# Altium project System Control.PrjPCB (part 3 of 3)

## Sheet System Control - Serial Port.SchDoc
size B; PageSetup: Record=PageOptions|CenterHorizontal=True|CenterVertical=True|PrintScale=1.09|XCorrection=1.00|YCorrection=1.00|PrintKind=1|BorderSize=5000000|LeftOffset=0|BottomOffset=0|Orientation=2|PaperLength=1000|PaperWidth=1000|Scale=100|PaperSource=261|PrintQuality=600|MediaType=1|DitherType=10|PaperKind=11x17|PrintScaleMode=1
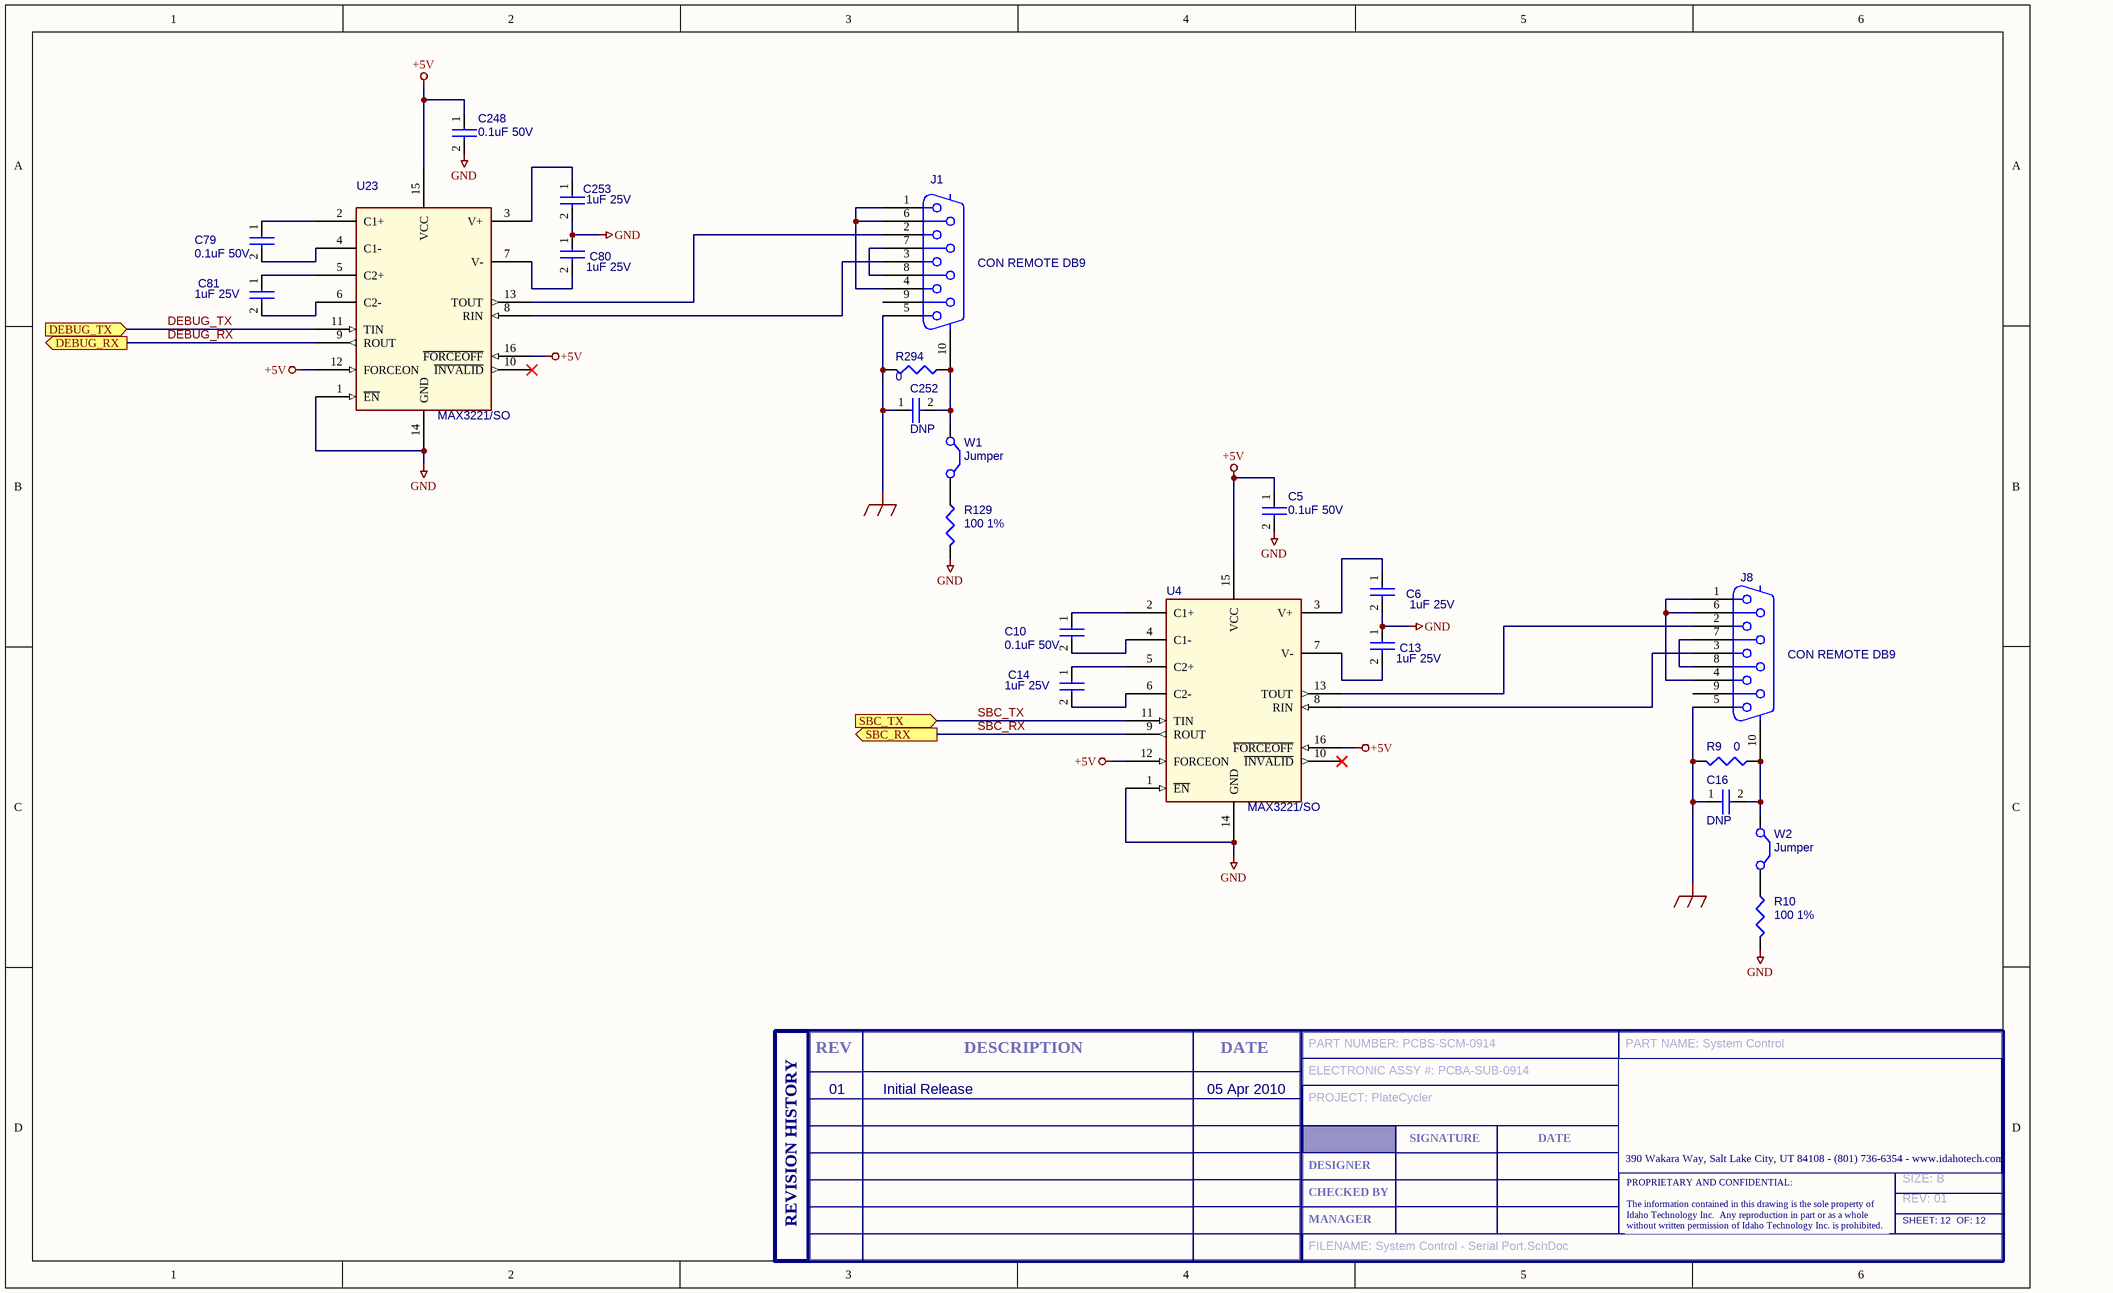
[diagram p14: System Control - Serial Port.SchDoc]

### Parts
(Parts that share a designator on the sheet are numbered #1, #2 ... from top to bottom, then left to right.)
C5  0.1uF 50V  [SM/C_0603]
C6  1uF 25V  [SM/C_0603]
C10  0.1uF 50V  [SM/C_0603]
C13  1uF 25V  [SM/C_0603]
C14  1uF 25V  [SM/C_0603]
C16  DNP  [SM/C_0603]  (no BOM)
C79  0.1uF 50V  [SM/C_0603]
C80  1uF 25V  [SM/C_0603]
C81  1uF 25V  [SM/C_0603]
C248  0.1uF 50V  [SM/C_0603]
C252  DNP  [SM/C_0603]  (no BOM)
C253  1uF 25V  [SM/C_0603]
J1  CON REMOTE DB9  [RS232 HEADER]
J8  CON REMOTE DB9  [RS232 HEADER]
R9  0  [SM/R_0603]
R10  100 1%  [0805]
R129  100 1%  [SM/R_0805]
R294  0  [SM/R_0603]
T?#12  SIZE: B  REV: 01  FILENAME: System Control - Serial Port.SchDoc  PART NUMBER: PCBS-SCM-0914  PART NAME: System Control  ELECTRONIC ASSY #: PCBA-SUB-0914  PROJECT: PlateCycler  SHEET: 12  (hidden comment: ITI Title Block, A Size)  (graphical)
U4  MAX3221/SO  [16TSSOP]
U23  MAX3221/SO  [SOG.65M/16/WG8.20/L6.35]
W1  Jumper  [HDR1X2]
W2  Jumper  [HDR1X2]

### Ports
DEBUG_RX (out), DEBUG_TX (in), SBC_RX (out), SBC_TX (in)

### Nets
+5V: C5.1 C248.1 U4.12(FORCEON) U4.15(VCC) U4.16(~{FORCEOFF}) U23.12(FORCEON) U23.15(VCC) U23.16(~{FORCEOFF})
EGND: C16.1 C252.1 J1.5 J8.5 R9.2 R294.2
GND: C5.2 C6.2 C13.1 C80.1 C248.2 C253.2 R10.2 R129.2 U4.1(~{EN}) U4.14(GND) U23.1(~{EN}) U23.14(GND)
DEBUG_RX: U23.9(ROUT) ; port DEBUG_RX
DEBUG_TX: U23.11(TIN) ; port DEBUG_TX
SBC_RX: U4.9(ROUT) ; port SBC_RX
SBC_TX: U4.11(TIN) ; port SBC_TX
NetC6_1: C6.1 U4.3(V+)
NetC10_1: C10.1 U4.2(C1+)
NetC10_2: C10.2 U4.4(C1-)
NetC13_2: C13.2 U4.7(V-)
NetC14_1: C14.1 U4.5(C2+)
NetC14_2: C14.2 U4.6(C2-)
NetC16_2: C16.2 J8.10 R9.1 W2.1(C1)
NetC79_1: C79.1 U23.2(C1+)
NetC79_2: C79.2 U23.4(C1-)
NetC80_2: C80.2 U23.7(V-)
NetC81_1: C81.1 U23.5(C2+)
NetC81_2: C81.2 U23.6(C2-)
NetC252_2: C252.2 J1.10 R294.1 W1.1(C1)
NetC253_1: C253.1 U23.3(V+)
NetJ1_1: J1.1 J1.4 J1.6
NetJ1_2: J1.2 U23.13(TOUT)
NetJ1_3: J1.3 U23.8(RIN)
NetJ1_7: J1.7 J1.8
NetJ8_1: J8.1 J8.4 J8.6
NetJ8_2: J8.2 U4.13(TOUT)
NetJ8_3: J8.3 U4.8(RIN)
NetJ8_7: J8.7 J8.8
NetR10_1: R10.1 W2.2(C2)
NetR129_1: R129.1 W1.2(C2)

Not connected (* = marked no-connect by the designer): J1 9; J8 9; U4 10(~{INVALID})*; U23 10(~{INVALID})*

### Notes on the sheet
- 01
- Initial Release
- 05 Apr 2010
- (in symbol ITI A-size Title Block and Rev Table) REV; DESCRIPTION; DATE; SIGNATURE; 390 Wakara Way, Salt Lake City, UT 84108 - (801) 736-6354 - www.idahotech.com; DESIGNER; CHECKED BY; REVISION HISTORY; MANAGER; PROPRIETARY AND CONFIDENTIAL: / The information contained in this drawing is the sole property of / Idaho Technology Inc.  Any reproduction in part or as a whole / without written permission of Idaho Technology Inc. is prohibited.

### Library data of the parts
C5 C10 C16 C79 C248 C252 = CAP NP_1: CAP CER .10UF 50V X7R 0603; Manufacturer P/N: UMK107B7104KA-T; Manufacturer: Taiyo Yuden; Vendor P/N: 587-1243-1-ND; Vendor: Digikey
C6 C13 C14 C80 C81 C253 = CAP NP_1: CAP 1UF 25V CERAMIC 0603 X5S; Manufacturer P/N: ECJ-1V41E105M; Manufacturer: Panasonic; Vendor P/N: PCC2354CT-ND; Vendor: Digikey
J1 J8 = CONNECTOR DB9_1: CONN HEADER 10 POS STRGHT GOLD; Manufacturer: 3M/ESD; Manufacturer P/N: N2510-6002RB; Vendor: Digikey; Vendor P/N: MHC10K-ND
R9 R294 = R0 5% 0603: RES ZERO OHM 1/10W 5% 0603 SMD; Manufacturer: Panasonic; Manufacturer P/N: ERJ-3GEY0R00V; Vendor: Digikey; Vendor P/N: P0.0GCT-ND
R10 R129 = R: RES 100 OHM 1/10W 1% 0805 SMD; Manufacturer: Panasonic; Manufacturer P/N: ERJ-6ENF1000V; Vendor: Digikey; Vendor P/N: P100CCT-ND
T?#12 = ITI A-size Title Block and Rev Table: ITI Title Block and Rev Table, A Size; OF: 12
U4 U23 = MAX3221/SO_0: IC DRVR/RCVR RS-232 1-CH 16TSSOP; Manufacturer: Maxim; Manufacturer P/N: MAX3221CPWR; Vendor: Digikey; Vendor P/N: 296-9594-1-ND
W1 W2 = Jumper: CONN HEADER 2POS .100" STR TIN; Manufacturer: Molex; Manufacturer P/N: 90120-0122; Vendor: Digikey; Vendor P/N: WM8072-ND; Published: 24-Mar-1999; LatestRevisionDate: 17-Jul-2002; LatestRevisionNote: Re-released for DXP Platform.; PackageReference: RAD-0.2; Publisher: Altium Limited

## Nets that join several sheets
+0.9V: System Control - Bank3 (R168.2), System Control - Power (C11.P C12.P U5.2 U5.4), System Control - SDRAM (77 pins)
+1.2V: System Control - FPGA Supply and Configuration (41 pins), System Control - Power Supervisors (U9.5), System Control - Power (5 pins)
+1.8V: System Control - FPGA Supply and Configuration (21 pins), System Control - Power Supervisors (R20.1), System Control - Power (7 pins), System Control - SDRAM (66 pins)
+2.5V: System Control - Power Supervisors (U7.2), System Control - Power (C4.P D2.1 TP8.1 U3.3)
+3.3V: System Control - Bank0 (15 pins), System Control - Bank1 (7 pins), System Control - Bank2 (J9.1), System Control - FPGA Supply and Configuration (100 pins), System Control - Mode DIP Switch (10 pins), System Control - Parallel Flash (8 pins), System Control - Power Supervisors (R16.1 U7.1), System Control - Power (6 pins), System Control - Serial Flash (10 pins)
+5V: System Control - Bank1 (DISP1.2 R5.2 W4.2), System Control - FPGA Supply and Configuration (D6.1), System Control - Power Supervisors (10 pins), System Control - Power (17 pins), System Control - Serial Port (8 pins)
DDR2_VREF: System Control - Bank3 (U11.M1 U11.R1 U11.R10), System Control - FPGA Supply and Configuration (14 pins), System Control - Power (C17.1 U5.7), System Control - SDRAM (C242.1 C245.1 U21.J2 U22.J2)
EGND: System Control - Power (5 pins), System Control - Serial Port (6 pins)
GND: System Control - Bank0 (29 pins), System Control - Bank1 (17 pins), System Control - Bank2 (J9.12), System Control - FPGA Supply and Configuration (179 pins), System Control - Mode DIP Switch (11 pins), System Control - Parallel Flash (9 pins), System Control - Power Supervisors (12 pins), System Control - Power (34 pins), System Control - SDRAM (83 pins), System Control - Serial Flash (10 pins), System Control - Serial Port (12 pins)
+VIN: System Control - Bank0 (J11.5), System Control - Power (C7.1 C8.P F3.1)
AB0: System Control - Bank1 (J5.1), System Control - Bank2 (U11.W9)
AB1: System Control - Bank1 (J5.2), System Control - Bank2 (U11.AD11)
AB2: System Control - Bank1 (J5.3), System Control - Bank2 (U11.AB7)
AB3: System Control - Bank1 (J5.4), System Control - Bank2 (U11.AE6)
ADC_CLK: System Control - Bank0 (J2.10), System Control - Bank1 (U11.P23)
ADC_DIN: System Control - Bank0 (J2.12), System Control - Bank1 (U11.L18)
ADC_DOUT: System Control - Bank0 (J2.13), System Control - Bank1 (U11.K19)
CLOSED_OUT: System Control - Bank0 (J6.5), System Control - Bank1 (U11.AD25)
CONFIG_SPI_MISO: System Control - Bank2 (R30.2 U11.AF24), System Control - Serial Flash (U12.8)
CONFIG_SPI_MOSI: System Control - Bank2 (U11.AB15), System Control - Serial Flash (U12.1)
CONFIG_SPI_SCK: System Control - Bank2 (R32.1), System Control - Serial Flash (C52.1 R163.2 U12.2)
CONFIG_SPI_SEL: System Control - Bank2 (U11.AA7), System Control - Serial Flash (C51.1 R156.1 U12.4)
DDR_A0: System Control - Bank3 (U11.M8), System Control - SDRAM (R269.2)
DDR_A1: System Control - Bank3 (U11.M3), System Control - SDRAM (R103.2)
DDR_A2: System Control - Bank3 (U11.M4), System Control - SDRAM (R263.2)
DDR_A3: System Control - Bank3 (U11.M6), System Control - SDRAM (R264.2)
DDR_A4: System Control - Bank3 (U11.M5), System Control - SDRAM (R262.2)
DDR_A5: System Control - Bank3 (U11.N4), System Control - SDRAM (R104.2)
DDR_A6: System Control - Bank3 (U11.N5), System Control - SDRAM (R105.2)
DDR_A7: System Control - Bank3 (U11.N2), System Control - SDRAM (R107.2)
DDR_A8: System Control - Bank3 (U11.N1), System Control - SDRAM (R109.2)
DDR_A9: System Control - Bank3 (U11.N7), System Control - SDRAM (R261.2)
DDR_A10: System Control - Bank3 (U11.N6), System Control - SDRAM (R260.2)
DDR_A11: System Control - Bank3 (U11.P2), System Control - SDRAM (R106.2)
DDR_A12: System Control - Bank3 (U11.P1), System Control - SDRAM (R102.2)
DDR_BS0: System Control - Bank3 (U11.L4), System Control - SDRAM (R267.1 R280.2)
DDR_BS1: System Control - Bank3 (U11.M7), System Control - SDRAM (R268.1 R281.2)
DDR_~{CAS}: System Control - Bank3 (U11.K5), System Control - SDRAM (R111.1 R115.2)
DDR_~{CLK0}: System Control - Bank3 (U11.R4), System Control - SDRAM (R289.2)
DDR_~{CLK1}: System Control - Bank3 (U11.P10), System Control - SDRAM (R290.2)
DDR_~{CS}: System Control - Bank3 (U11.K3), System Control - SDRAM (R110.1 R114.2)
DDR_CKE: System Control - Bank3 (U11.L3), System Control - SDRAM (R265.2)
DDR_CLK0: System Control - Bank3 (U11.R3), System Control - SDRAM (R284.2)
DDR_CLK1: System Control - Bank3 (U11.N9), System Control - SDRAM (R286.2)
DDR_D0: System Control - Bank3 (U11.AD1), System Control - SDRAM (R51.1 R76.1)
DDR_D1: System Control - Bank3 (U11.AD2), System Control - SDRAM (R202.1 R230.1)
DDR_D2: System Control - Bank3 (U11.AC2), System Control - SDRAM (R195.1 R223.1)
DDR_D3: System Control - Bank3 (U11.AC3), System Control - SDRAM (R198.1 R226.1)
DDR_D4: System Control - Bank3 (U11.U9), System Control - SDRAM (R201.1 R231.1)
DDR_D5: System Control - Bank3 (U11.V8), System Control - SDRAM (R192.1 R221.1)
DDR_D6: System Control - Bank3 (U11.AB1), System Control - SDRAM (R60.1 R85.1)
DDR_D7: System Control - Bank3 (U11.AC1), System Control - SDRAM (R52.1 R77.1)
DDR_D8: System Control - Bank3 (U11.V7), System Control - SDRAM (R193.1 R224.1)
DDR_D9: System Control - Bank3 (U11.V6), System Control - SDRAM (R56.1 R83.1)
DDR_D10: System Control - Bank3 (U11.Y5), System Control - SDRAM (R58.1 R82.1)
DDR_D11: System Control - Bank3 (U11.Y6), System Control - SDRAM (R196.1 R227.1)
DDR_D12: System Control - Bank3 (U11.AA2), System Control - SDRAM (R61.1 R86.1)
DDR_D13: System Control - Bank3 (U11.AA3), System Control - SDRAM (R54.1 R78.1)
DDR_D14: System Control - Bank3 (U11.Y1), System Control - SDRAM (R59.1 R84.1)
DDR_D15: System Control - Bank3 (U11.Y2), System Control - SDRAM (R53.1 R79.1)
DDR_D16: System Control - Bank3 (U11.T7), System Control - SDRAM (R62.1 R87.1)
DDR_D17: System Control - Bank3 (U11.V5), System Control - SDRAM (R72.1 R97.1)
DDR_D18: System Control - Bank3 (U11.U5), System Control - SDRAM (R207.1 R237.1)
DDR_D19: System Control - Bank3 (U11.T9), System Control - SDRAM (R210.1 R241.1)
DDR_D20: System Control - Bank3 (U11.R8), System Control - SDRAM (R213.1 R242.1)
DDR_D21: System Control - Bank3 (U11.R7), System Control - SDRAM (R203.1 R233.1)
DDR_D22: System Control - Bank3 (U11.U1), System Control - SDRAM (R71.1 R96.1)
DDR_D23: System Control - Bank3 (U11.U2), System Control - SDRAM (R63.1 R88.1)
DDR_D24: System Control - Bank3 (U11.T5), System Control - SDRAM (R205.1 R235.1)
DDR_D25: System Control - Bank3 (U11.R9), System Control - SDRAM (R68.1 R93.1)
DDR_D26: System Control - Bank3 (U11.P8), System Control - SDRAM (R66.1 R91.1)
DDR_D27: System Control - Bank3 (U11.P9), System Control - SDRAM (R208.1 R238.1)
DDR_D28: System Control - Bank3 (U11.P7), System Control - SDRAM (R70.1 R94.1)
DDR_D29: System Control - Bank3 (U11.P6), System Control - SDRAM (R206.1 R234.1)
DDR_D30: System Control - Bank3 (U11.T3), System Control - SDRAM (R69.1 R95.1)
DDR_D31: System Control - Bank3 (U11.T4), System Control - SDRAM (R64.1 R89.1)
DDR_~{LDQS0}: System Control - Bank3 (U11.W6), System Control - SDRAM (R194.1)
DDR_~{LDQS1}: System Control - Bank3 (U11.U8), System Control - SDRAM (R55.1)
DDR_LDM0: System Control - Bank3 (U11.U6), System Control - SDRAM (R200.1)
DDR_LDM1: System Control - Bank3 (U11.U4), System Control - SDRAM (R211.1)
DDR_LDQS0: System Control - Bank3 (U11.W7), System Control - SDRAM (R197.1)
DDR_LDQS1: System Control - Bank3 (U11.U7), System Control - SDRAM (R57.1)
DDR_ODT_Control: System Control - Bank3 (U11.M10), System Control - SDRAM (R112.1)
DDR_~{RAS}: System Control - Bank3 (U11.K2), System Control - SDRAM (R108.1 R113.2)
DDR_~{UDQS0}: System Control - Bank3 (U11.V2), System Control - SDRAM (R204.1)
DDR_~{UDQS1}: System Control - Bank3 (U11.R6), System Control - SDRAM (R65.1)
DDR_UDM0: System Control - Bank3 (U11.T10), System Control - SDRAM (R199.1)
DDR_UDM1: System Control - Bank3 (U11.P4), System Control - SDRAM (R212.1)
DDR_UDQS0: System Control - Bank3 (U11.V1), System Control - SDRAM (R209.1)
DDR_UDQS1: System Control - Bank3 (U11.R5), System Control - SDRAM (R67.1)
DDR_~{WE}: System Control - Bank3 (U11.K4), System Control - SDRAM (R266.1 R278.2)
DEBUG_RX: System Control - Bank0 (U11.A4), System Control - Serial Port (U23.9)
DEBUG_TX: System Control - Bank0 (U11.A3), System Control - Serial Port (U23.11)
DIN: System Control - Bank0 (J2.1), System Control - Bank1 (U11.N19)
DINB: System Control - Bank1 (J5.8), System Control - Bank2 (U11.Y9)
DIR_IN: System Control - Bank0 (J6.4), System Control - Bank2 (U11.AE23)
DOOR_EN: System Control - Bank0 (J6.12), System Control - Bank1 (U11.AA25)
DOUTB: System Control - Bank1 (J5.10), System Control - Bank2 (U11.AE3)
FILTER_EN: System Control - Bank0 (J6.10), System Control - Bank1 (U11.Y23)
FPGA_M0: System Control - Bank2 (U11.AD4), System Control - Mode DIP Switch (Q9.1 R152.1 S2.8)
FPGA_M1: System Control - Bank2 (U11.AC4), System Control - Mode DIP Switch (Q10.1 R153.1 S2.7)
FPGA_M2: System Control - Bank2 (U11.Y7), System Control - Mode DIP Switch (Q11.1 R155.1 S2.6)
INA1_1: System Control - Bank0 (J4.2), System Control - Bank1 (U11.G21)
INA1_2: System Control - Bank0 (J4.6), System Control - Bank1 (U11.F25)
INA1_3: System Control - Bank0 (J4.12), System Control - Bank1 (U11.D25)
INA1_7: System Control - Bank0 (J4.32), System Control - Bank1 (U11.K18)
INA2_1: System Control - Bank0 (J4.4), System Control - Bank1 (U11.G24)
INA2_2: System Control - Bank0 (J4.8), System Control - Bank1 (U11.G23)
INB1_1: System Control - Bank1 (J12.2), System Control - Bank2 (U11.AD17)
INB1_2: System Control - Bank1 (J12.6), System Control - Bank2 (U11.W17)
INB1_3: System Control - Bank1 (J12.12), System Control - Bank2 (U11.AE15)
INB1_4: System Control - Bank1 (J12.16), System Control - Bank2 (U11.AC11)
INB1_5: System Control - Bank1 (J12.22), System Control - Bank2 (U11.AD7)
INB1_6: System Control - Bank1 (J12.26), System Control - Bank2 (U11.Y10)
INB1_7: System Control - Bank1 (J12.32), System Control - Bank2 (U11.AF5)
INB1_8: System Control - Bank1 (J13.2), System Control - Bank2 (U11.AA15)
INB1_9: System Control - Bank1 (J13.8), System Control - Bank2 (U11.AE13)
INB1_10: System Control - Bank1 (J13.12), System Control - Bank2 (U11.AD14)
INB1_11: System Control - Bank1 (J13.18), System Control - Bank2 (U11.AB16)
INB1_12: System Control - Bank1 (J13.22), System Control - Bank2 (U11.AB18)
INB2_1: System Control - Bank1 (J12.4), System Control - Bank2 (U11.AE17)
INB2_2: System Control - Bank1 (J12.8), System Control - Bank2 (U11.AC14)
INB2_3: System Control - Bank1 (J12.14), System Control - Bank2 (U11.V10)
INB2_4: System Control - Bank1 (J12.18), System Control - Bank2 (U11.AE9)
INB2_5: System Control - Bank1 (J12.24), System Control - Bank2 (U11.AF8)
INB2_6: System Control - Bank1 (J12.28), System Control - Bank2 (U11.AA12)
INB2_7: System Control - Bank1 (J12.34), System Control - Bank2 (U11.AD6)
INB2_8: System Control - Bank1 (J13.4), System Control - Bank2 (U11.AA13)
INB2_9: System Control - Bank1 (J13.10), System Control - Bank2 (U11.AF13)
INB2_12: System Control - Bank1 (J13.24), System Control - Bank2 (U11.Y17)
IO1: System Control - Bank1 (U11.B13), System Control - Bank2 (J9.2)
IO2: System Control - Bank1 (U11.C15), System Control - Bank2 (J9.3)
IO3: System Control - Bank1 (U11.J19), System Control - Bank2 (J9.4)
IO4: System Control - Bank1 (U11.F17), System Control - Bank2 (J9.5)
IO5: System Control - Bank1 (U11.E15), System Control - Bank2 (J9.6)
IO6: System Control - Bank1 (U11.J23), System Control - Bank2 (J9.7)
IO7: System Control - Bank1 (U11.J22), System Control - Bank2 (J9.8)
IO8: System Control - Bank1 (U11.K25), System Control - Bank2 (J9.9)
IO9: System Control - Bank1 (U11.K22), System Control - Bank2 (J9.10)
IO10: System Control - Bank1 (U11.K23), System Control - Bank2 (J9.11)
LCD_D1: System Control - Bank0 (U11.C17), System Control - Bank1 (DISP1.7)
LCD_D3: System Control - Bank0 (U11.B15), System Control - Bank1 (DISP1.9)
LCD_D4: System Control - Bank0 (U11.J16), System Control - Bank1 (DISP1.10)
LCD_D5: System Control - Bank0 (U11.D16), System Control - Bank1 (DISP1.11)
LCD_D6: System Control - Bank0 (U11.B14), System Control - Bank1 (DISP1.12)
LCD_D7: System Control - Bank0 (U11.C13), System Control - Bank1 (DISP1.13)
LCD_D8: System Control - Bank0 (U11.D13), System Control - Bank1 (DISP1.14)
LCD_EN: System Control - Bank0 (U11.G17), System Control - Bank1 (DISP1.6)
LCD_R/~W: System Control - Bank0 (U11.B18), System Control - Bank1 (DISP1.5)
LCD_RS: System Control - Bank0 (U11.D18), System Control - Bank1 (DISP1.4)
LED7: System Control - Bank0 (LD4.1 TP13.1), System Control - Bank1 (U11.D26)
LED8: System Control - Bank0 (LD5.1 TP14.1), System Control - Bank1 (U11.F24)
LED9: System Control - Bank0 (LD6.1 TP15.1), System Control - Bank1 (U11.K21)
LED10: System Control - Bank0 (LD7.1 TP16.1), System Control - Bank1 (U11.E26)
LED_ENABLE: System Control - Bank0 (J2.8), System Control - Bank1 (U11.P20)
LID_EN: System Control - Bank0 (J6.8), System Control - Bank1 (U11.AA24)
LIDPWMA: System Control - Bank0 (J11.2 TP2.1), System Control - Bank2 (U11.AC21)
LIDPWMB: System Control - Bank0 (J11.1 TP1.1), System Control - Bank2 (U11.AE21)
OPEN_OUT: System Control - Bank0 (J6.3), System Control - Bank2 (U11.AD22)
PARALLEL_FLASH_A0: System Control - Bank1 (U11.AC23), System Control - Parallel Flash (U6.32)
PARALLEL_FLASH_A1: System Control - Bank1 (U11.AC24), System Control - Parallel Flash (U6.28)
PARALLEL_FLASH_A2: System Control - Bank1 (U11.R21), System Control - Parallel Flash (U6.27)
PARALLEL_FLASH_A3: System Control - Bank1 (U11.R22), System Control - Parallel Flash (U6.26)
PARALLEL_FLASH_A4: System Control - Bank1 (U11.T23), System Control - Parallel Flash (U6.25)
PARALLEL_FLASH_A5: System Control - Bank1 (U11.T24), System Control - Parallel Flash (U6.24)
PARALLEL_FLASH_A6: System Control - Bank1 (U11.R18), System Control - Parallel Flash (U6.23)
PARALLEL_FLASH_A7: System Control - Bank1 (U11.R17), System Control - Parallel Flash (U6.22)
PARALLEL_FLASH_A8: System Control - Bank1 (U11.R25), System Control - Parallel Flash (U6.20)
PARALLEL_FLASH_A9: System Control - Bank1 (U11.R26), System Control - Parallel Flash (U6.19)
PARALLEL_FLASH_A10: System Control - Bank1 (U11.M26), System Control - Parallel Flash (U6.18)
PARALLEL_FLASH_A11: System Control - Bank1 (U11.M25), System Control - Parallel Flash (U6.17)
PARALLEL_FLASH_A12: System Control - Bank1 (U11.L24), System Control - Parallel Flash (U6.13)
PARALLEL_FLASH_A13: System Control - Bank1 (U11.M23), System Control - Parallel Flash (U6.12)
PARALLEL_FLASH_A14: System Control - Bank1 (U11.N18), System Control - Parallel Flash (U6.11)
PARALLEL_FLASH_A15: System Control - Bank1 (U11.N17), System Control - Parallel Flash (U6.10)
PARALLEL_FLASH_A16: System Control - Bank1 (U11.N20), System Control - Parallel Flash (U6.8)
PARALLEL_FLASH_A17: System Control - Bank1 (U11.M20), System Control - Parallel Flash (U6.7)
PARALLEL_FLASH_A18: System Control - Bank1 (U11.J26), System Control - Parallel Flash (U6.6)
PARALLEL_FLASH_A19: System Control - Bank1 (U11.J25), System Control - Parallel Flash (U6.5)
PARALLEL_FLASH_A20: System Control - Bank1 (U11.J21), System Control - Parallel Flash (U6.4)
PARALLEL_FLASH_A21: System Control - Bank1 (U11.H21), System Control - Parallel Flash (U6.3)
PARALLEL_FLASH_A22: System Control - Bank1 (U11.C26), System Control - Parallel Flash (U6.1)
PARALLEL_FLASH_A23: System Control - Bank1 (U11.C25), System Control - Parallel Flash (U6.30)
PARALLEL_FLASH_~{BYTE}: System Control - Bank2 (U11.AE25), System Control - Parallel Flash (R21.1 R26.2 U6.31)
PARALLEL_FLASH_~{CE}: System Control - Bank1 (U11.P26), System Control - Parallel Flash (U6.14)
PARALLEL_FLASH_D0: System Control - Bank2 (R27.1 R30.1), System Control - Parallel Flash (U6.33)
PARALLEL_FLASH_D1: System Control - Bank2 (U11.AE18), System Control - Parallel Flash (U6.35)
PARALLEL_FLASH_D2: System Control - Bank2 (U11.AF18), System Control - Parallel Flash (U6.38)
PARALLEL_FLASH_D3: System Control - Bank2 (U11.Y15), System Control - Parallel Flash (U6.40)
PARALLEL_FLASH_D4: System Control - Bank2 (U11.AE12), System Control - Parallel Flash (U6.44)
PARALLEL_FLASH_D5: System Control - Bank2 (U11.AF12), System Control - Parallel Flash (U6.46)
PARALLEL_FLASH_D6: System Control - Bank2 (U11.AF10), System Control - Parallel Flash (U6.49)
PARALLEL_FLASH_D7: System Control - Bank2 (U11.AE10), System Control - Parallel Flash (U6.51)
PARALLEL_FLASH_D8: System Control - Bank2 (U11.AD20), System Control - Parallel Flash (U6.34)
PARALLEL_FLASH_D9: System Control - Bank2 (U11.AF19), System Control - Parallel Flash (U6.36)
PARALLEL_FLASH_D10: System Control - Bank2 (U11.AF20), System Control - Parallel Flash (U6.39)
PARALLEL_FLASH_D11: System Control - Bank2 (U11.AF23), System Control - Parallel Flash (U6.41)
PARALLEL_FLASH_D12: System Control - Bank1 (U11.AA23), System Control - Parallel Flash (U6.45)
PARALLEL_FLASH_D13: System Control - Bank1 (U11.AE26), System Control - Parallel Flash (U6.47)
PARALLEL_FLASH_D14: System Control - Bank1 (U11.AD26), System Control - Parallel Flash (U6.50)
PARALLEL_FLASH_D15: System Control - Bank1 (U11.AC26), System Control - Parallel Flash (U6.52)
PARALLEL_FLASH_~{OE}: System Control - Bank1 (U11.AC25), System Control - Parallel Flash (U6.54)
PARALLEL_FLASH_~{RESET}: System Control - Bank1 (U11.P21), System Control - Parallel Flash (R146.1 U6.16)
PARALLEL_FLASH_VPEN: System Control - Bank1 (U11.P22), System Control - Parallel Flash (R147.2 U6.15)
PARALLEL_FLASH_~{WE}: System Control - Bank1 (U11.AB26), System Control - Parallel Flash (U6.55)
POWER_SUPERVISOR_~{RST}: System Control - Bank2 (U11.AE19), System Control - Power Supervisors (C31.1 Q2.3 R16.2)
PTH_TRACK: System Control - FPGA Supply and Configuration (U26.2), System Control - Power Supervisors (R24.1 U9.3 U10.1), System Control - Power (U5.11 U5.12)
S0_IN: System Control - Bank0 (J6.9), System Control - Bank1 (U11.AB24)
S1_IN: System Control - Bank0 (J6.7), System Control - Bank1 (U11.AB23)
SBC_RX: System Control - Bank1 (U11.P25), System Control - Serial Port (U4.9)
SBC_TX: System Control - Bank1 (U11.R19), System Control - Serial Port (U4.11)
SCKB: System Control - Bank1 (J5.6), System Control - Bank2 (U11.AA10)
SCLK: System Control - Bank0 (J2.2), System Control - Bank1 (U11.P18)
STEP_IN: System Control - Bank0 (J6.2), System Control - Bank2 (U11.AD21)
SW_1: System Control - Bank1 (U11.L17), System Control - Mode DIP Switch (R47.1 S4.8)
SW_2: System Control - Bank1 (U11.L20), System Control - Mode DIP Switch (R48.1 S4.7)
SW_3: System Control - Bank1 (U11.K26), System Control - Mode DIP Switch (R49.1 S4.6)
SW_4: System Control - Bank0 (U11.G19), System Control - Mode DIP Switch (R50.1 S4.5)
USER_SPI_MISO: System Control - Bank2 (U11.AF4), System Control - Serial Flash (U2.8)
USER_SPI_MOSI: System Control - Bank2 (U11.Y12), System Control - Serial Flash (U2.1)
USER_SPI_~{SEL}: System Control - Bank2 (U11.AC8), System Control - Serial Flash (C19.1 R11.1 U2.4)
USER_SPI_SCK: System Control - Bank2 (U11.AF3), System Control - Serial Flash (C20.1 R15.2 U2.2)
~ADC_CS: System Control - Bank0 (J2.11), System Control - Bank1 (U11.N24)
~ANALOG_CONTROL: System Control - Bank0 (J2.9), System Control - Bank1 (U11.L22)
~DA1: System Control - Bank0 (J4.5), System Control - Bank1 (U11.F23)
~DA2: System Control - Bank0 (J4.9), System Control - Bank1 (U11.E24)
~DA6: System Control - Bank0 (J4.27), System Control - Bank1 (U11.K20)
~DB1: System Control - Bank1 (J12.5), System Control - Bank2 (U11.AC16)
~DB2: System Control - Bank1 (J12.9), System Control - Bank2 (U11.V12)
~DB3: System Control - Bank1 (J12.13), System Control - Bank2 (U11.AC12)
~DB4: System Control - Bank1 (J12.17), System Control - Bank2 (U11.AF9)
~DB5: System Control - Bank1 (J12.23), System Control - Bank2 (U11.AE8)
~DB6: System Control - Bank1 (J12.27), System Control - Bank2 (U11.AE7)
~DB7: System Control - Bank1 (J12.33), System Control - Bank2 (U11.AE4)
~DB8: System Control - Bank1 (J13.3), System Control - Bank2 (U11.AE14)
~DB9: System Control - Bank1 (J13.9), System Control - Bank2 (U11.AF14)
~FSA_2: System Control - Bank0 (J4.11), System Control - Bank1 (U11.D24)
~FSB_1: System Control - Bank1 (J12.7), System Control - Bank2 (U11.U16)
~FSB_2: System Control - Bank1 (J12.11), System Control - Bank2 (U11.W12)
~FSB_3: System Control - Bank1 (J12.15), System Control - Bank2 (U11.H12)
~FSB_4: System Control - Bank0 (U11.AC9), System Control - Bank1 (J12.19)
~FSB_5: System Control - Bank1 (J12.25), System Control - Bank2 (U11.AC6)
~FSB_6: System Control - Bank1 (J12.29), System Control - Bank2 (U11.AB9)
~FSB_7: System Control - Bank1 (J13.1), System Control - Bank2 (U11.AB12)
~FSB_8: System Control - Bank1 (J13.5), System Control - Bank2 (U11.W10)
~FSB_9: System Control - Bank1 (J13.11), System Control - Bank2 (U11.V16)
~FSB_10: System Control - Bank1 (J13.15), System Control - Bank2 (U11.AA17)
~FSB_11: System Control - Bank1 (J13.21), System Control - Bank2 (U11.AA18)
~FSB_12: System Control - Bank1 (J13.25), System Control - Bank2 (U11.AC19)
~SYNC1: System Control - Bank0 (J2.3), System Control - Bank1 (U11.N21)
~SYNC2: System Control - Bank0 (J2.4), System Control - Bank1 (U11.M19)
~SYNC3: System Control - Bank0 (J2.5), System Control - Bank1 (U11.M18)
~SYNC4: System Control - Bank0 (J2.6), System Control - Bank1 (U11.M21)
~SYNC5: System Control - Bank0 (J2.7), System Control - Bank1 (U11.M22)